# EAGLE design AskelmoottoriV3 (EAGLE 9.4.2)
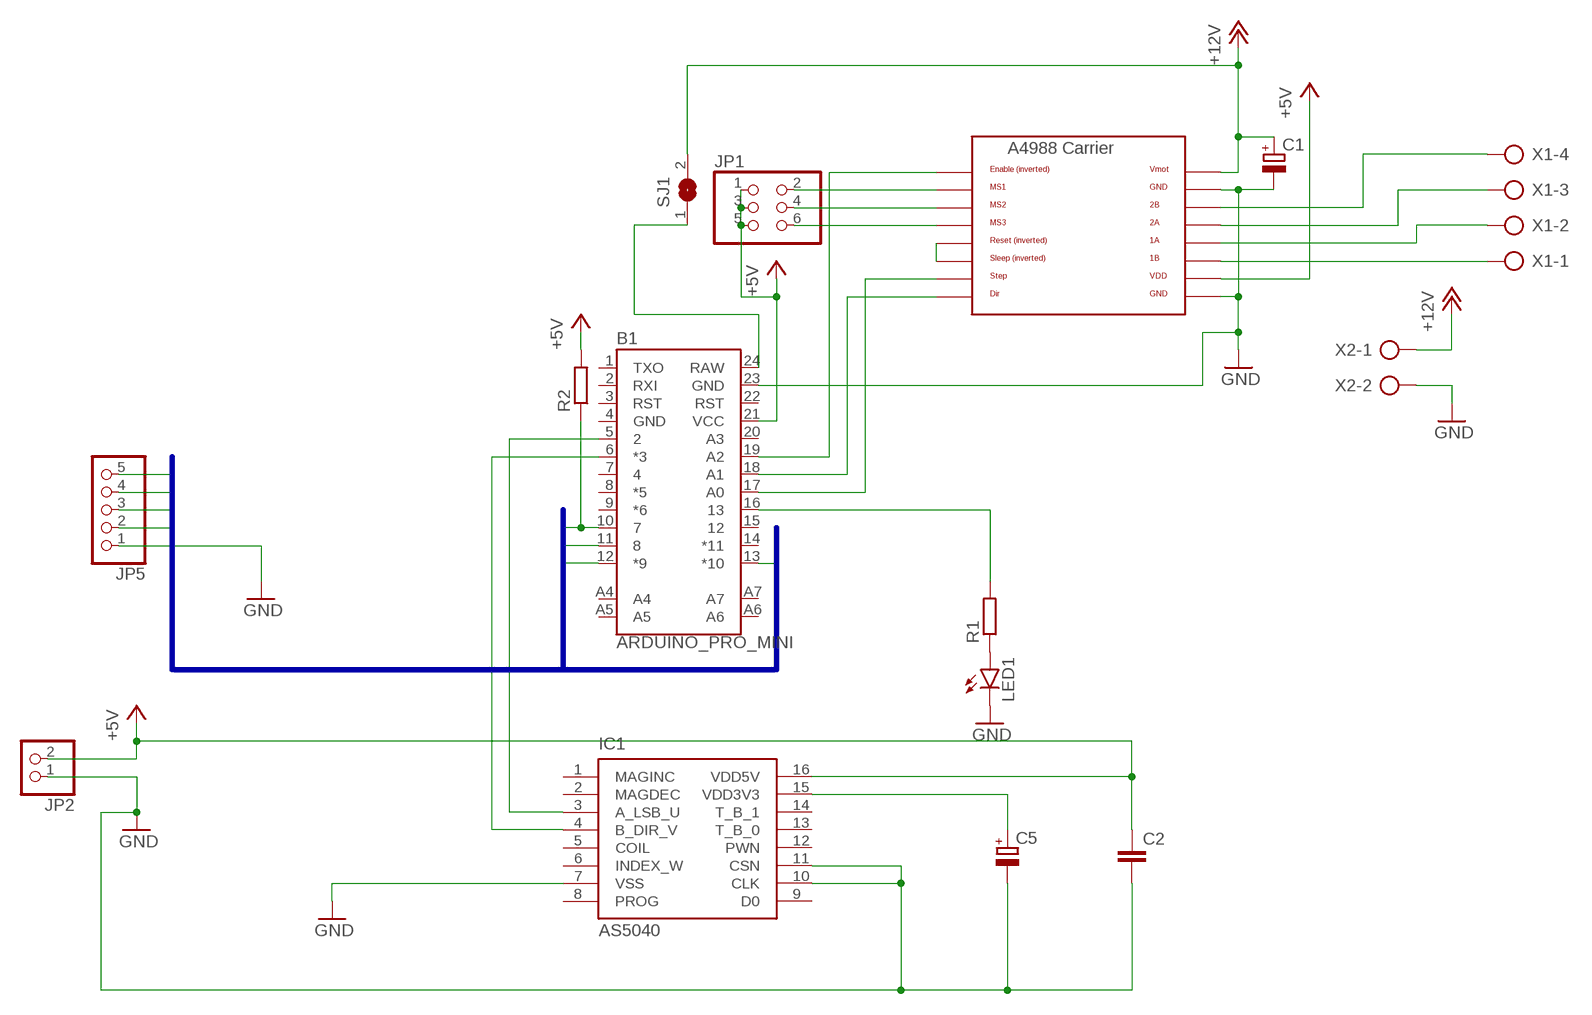
[diagram p0: schematic, sheet 1]

## Parts
B1  ARDUINO_PRO_MINI  [ARDUINO_PRO_MINI]
C1  CPOL-EUE5-8.5  [E5-8,5]
C2  C-EU025-030X050  [C025-030X050]
C5  CPOL-EUE2.5-5  [E2,5-5]
IC1  AS5040  [SSOP16]
JP1  PINHD-2X3  [2X03]
JP2  PINHD-1X2  [1X02]
JP5  PINHD-1X5  [1X05]
LED1  LED3MM  [LED3MM]
R1  R-EU_0207/10  [0207/10]
R2  R-EU_0207/10  [0207/10]
SJ1  SJ  [SJ]
U$1  A4988BREAKOUT  [A4988BREAKOUT]
X1  AK300/4  [AK300/4]
X2  AK300/2  [AK300/2]

## Nets
+5V: B1.21(VCC) C2.1 IC1.16(VDD5V) JP1.1 JP1.3 JP1.5 JP2.2 R2.2 U$1.VDD
+12V: C1.+ SJ1.2 U$1.VMOT X2.1
DIR: B1.12(*9) JP5.3
EN: B1.13(*10) JP5.4
FEED_HOLD: B1.10 JP5.5 R2.1
GND: B1.23(GND) C1.- C2.2 C5.- IC1.7(VSS) IC1.10(CLK) IC1.11(CSN) JP2.1 JP5.1 LED1.K(C) U$1.GND U$1.GND@0(GND) X2.2
N$1: U$1.2B X1.4
N$2: U$1.2A X1.3
N$3: U$1.1A X1.2
N$4: U$1.1B X1.1
N$6: B1.6(*3) IC1.4(B_DIR_V)
N$7: B1.16 R1.2
N$8: B1.17(A0) U$1.STEP
N$9: B1.18(A1) U$1.DIR
N$10: B1.19(A2) U$1.EN
N$11: U$1.RST U$1.SLP(SLEEP)
N$12: JP1.2 U$1.MS1
N$13: JP1.4 U$1.MS2
N$14: B1.24(RAW) SJ1.1
N$15: C5.+ IC1.15(VDD3V3)
N$16: JP1.6 U$1.MS3
N$17: B1.5 IC1.3(A_LSB_U)
N$20: LED1.A R1.1
STEP: B1.11 JP5.2
Unconnected: B1.1(TXO) B1.2(RXI) B1.3(RST) B1.7 B1.8(*5) B1.9(*6) B1.14(*11) B1.15 B1.20(A3) B1.22(RST) B1.A4 B1.A5 B1.A6 B1.A7 IC1.1(MAGINC) IC1.2(MAGDEC) IC1.5(COIL) IC1.6(INDEX_W) IC1.8(PROG) IC1.9(D0) IC1.12(PWN) IC1.13(T_B_0) IC1.14(T_B_1)

## Buses
STEP_IN_BUS:DIR,EN,FEED_HOLD,GND,STEP

## Power pins joined to a net without a drawn wire
GND: B1.4(GND)

## Library data of the parts
B1 = SparkFun-Boards:ARDUINO_PRO_MINI: SparkFun Pro Mini Pro Mini compatible footprint. Dimensions: 0.7 x 1.3" PCB Thickness: 0.8mm SparkFun Products: 3.3V/8MHz <https://www.sparkfun.com/products/11114> 5V/16MHz <https://www.sparkfun.com/products/11113>
C1 C5 = rcl:CPOL-EU: POLARIZED CAPACITOR, European symbol; SPICEPREFIX: C
C2 = rcl:C-EU: CAPACITOR, European symbol; SPICEPREFIX: C
IC1 = austriamicrosystems:AS5040: 10-BIT PROGRAMMABLE MAGNETIC ROTARY ENCODER Source: www.austriamicrosystems.com .. AS5040DataSheetRev12.pdf; MPN: AS5040ASSU; OC_FARNELL: 1630800; OC_NEWARK: 59P4059
JP1 = pinhead:PINHD-2X3: PIN HEADER
JP2 = pinhead:PINHD-1X2: PIN HEADER
JP5 = pinhead:PINHD-1X5: PIN HEADER
LED1 = led:LED: LED OSRAM: - CHIPLED LG R971, LG N971, LY N971, LG Q971, LY Q971, LO R971, LY R971 LH N974, LH R974 LS Q976, LO Q976, LY Q976 LO Q996 - Hyper CHIPLED LW Q18S LB Q993, LB Q99A, LB R99A - SideLED LS A670, LO A670, LY A670, LG A670, LP A670 LB A673, LV A673, LT A673, LW A673 LH A674 LY A675 LS A676, LA A676, LO A676, LY A676, LW A676 LS A679, LY A679, LG A679 - Hyper Micro SIDELED® LS Y876, LA Y876, LO Y876, LY Y876 LT Y87S - SmartLED LW L88C, LW L88S LB L89C, LB L89S, LG L890 LS L89K, LO L89K, LY L89K LS L896, LA L896, LO L896, LY L896 - TOPLED LS T670, LO T670, LY T670, LG T670, LP T670 LSG T670, LSP T670, LSY T670, LOP T670, LYG T670 LG T671, LOG T671, LSG T671 LB T673, LV T673, LT T673, LW T673 LH T674 LS T676, LA T676, LO T676, LY T676, LB T676, LH T676, LSB T676, LW T676 LB T67C, LV T67C, LT T67C, LS T67K, LO T67K, LY T67K, LW E67C LS E67B, LA E67B, LO E67B, LY E67B, LB E67C, LV E67C, LT E67C LW T67C LS T679, LY T679, LG T679 LS T770, LO T770, LY T770, LG T770, LP T770 LB T773, LV T773, LT T773, LW T773 LH T774 LS E675, LA E675, LY E675, LS T675 LS T776, LA T776, LO T776, LY T776, LB T776 LHGB T686 LT T68C, LB T68C - Hyper Mini TOPLED® LB M676 - Mini TOPLED Santana® LG M470 LS M47K, LO M47K, LY M47K Source: http://www.osram.convergy.de LUXEON: - LUMILED® LXK2-PW12-R00, LXK2-PW12-S00, LXK2-PW14-U00, LXK2-PW14-V00 LXK2-PM12-R00, LXK2-PM12-S00, LXK2-PM14-U00 LXK2-PE12-Q00, LXK2-PE12-R00, LXK2-PE12-S00, LXK2-PE14-T00, LXK2-PE14-U00 LXK2-PB12-K00, LXK2-PB12-L00, LXK2-PB12-M00, LXK2-PB14-N00, LXK2-PB14-P00, LXK2-PB14-Q00 LXK2-PR12-L00, LXK2-PR12-M00, LXK2-PR14-Q00, LXK2-PR14-R00 LXK2-PD12-Q00, LXK2-PD12-R00, LXK2-PD12-S00 LXK2-PH12-R00, LXK2-PH12-S00 LXK2-PL12-P00, LXK2-PL12-Q00, LXK2-PL12-R00 Source: www.luxeon.com KINGBRIGHT: KA-3528ASYC Source: www.kingbright.com
R1 R2 = rcl:R-EU_: RESISTOR, European symbol; SPICEPREFIX: R
SJ1 = jumper:SJ: SMD solder JUMPER
U$1 = RepRapjr:A4988BREAKOUT
X1 = con-ptr500:AK300/4: CONNECTOR; OC_FARNELL: unknown; OC_NEWARK: unknown
X2 = con-ptr500:AK300/2: CONNECTOR; OC_FARNELL: unknown; OC_NEWARK: unknown

## Board
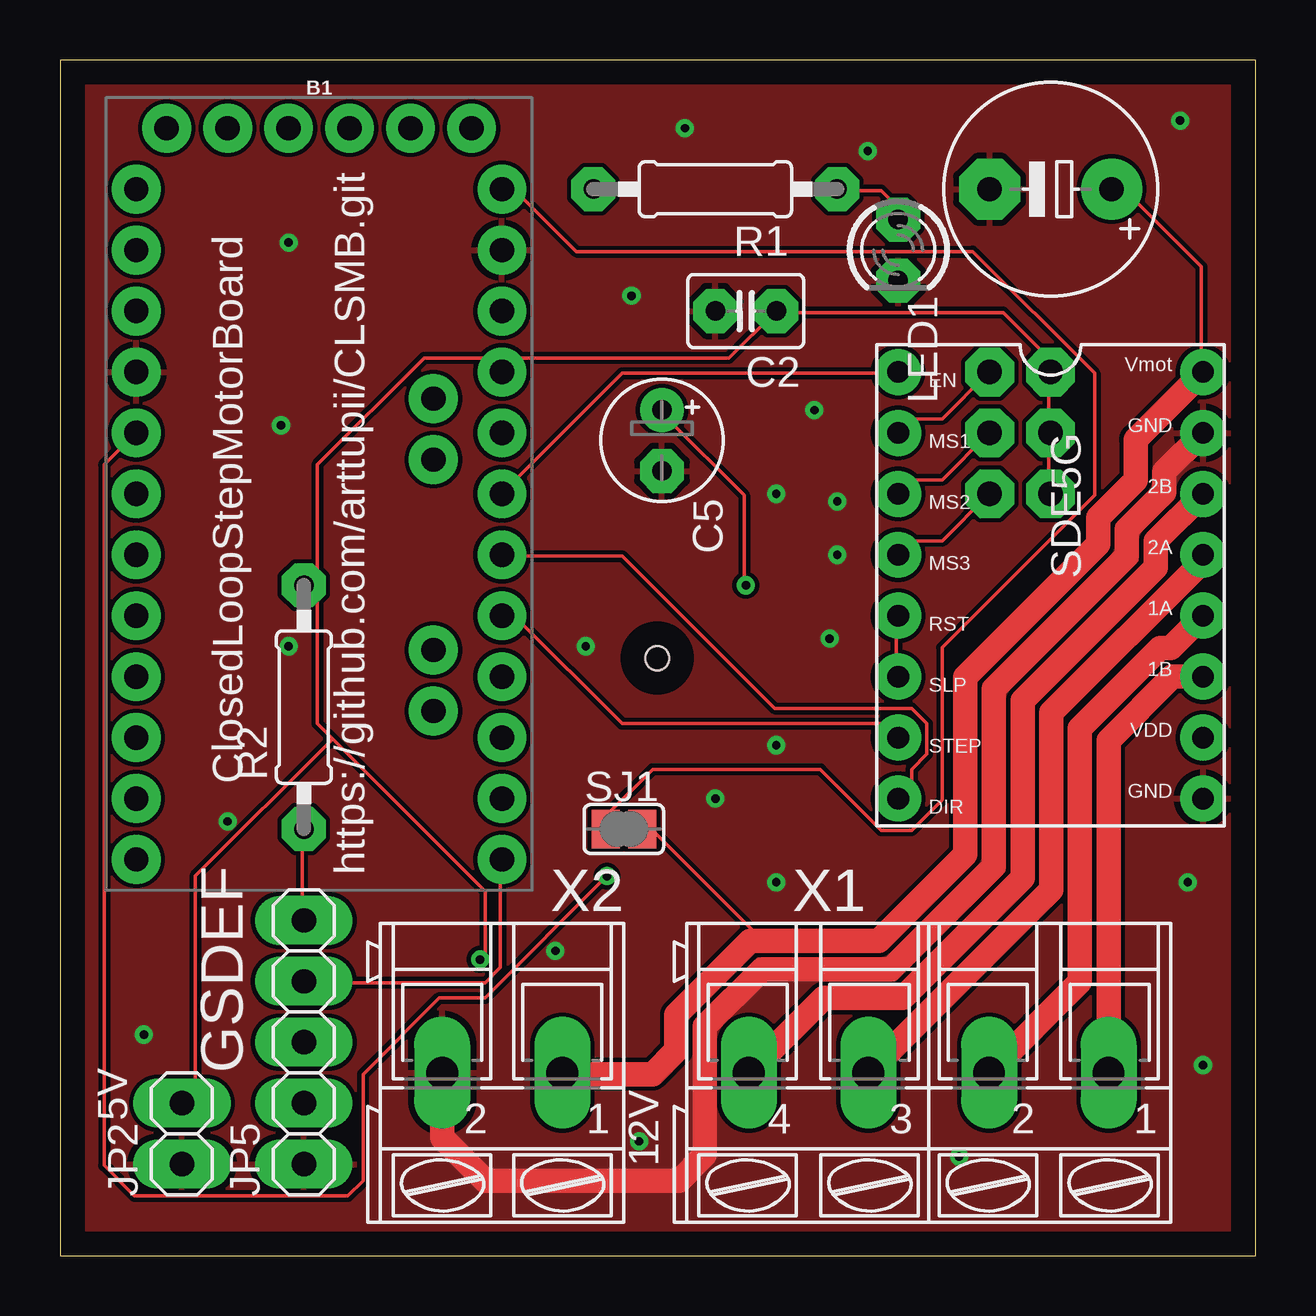
[diagram p1: board, top side]
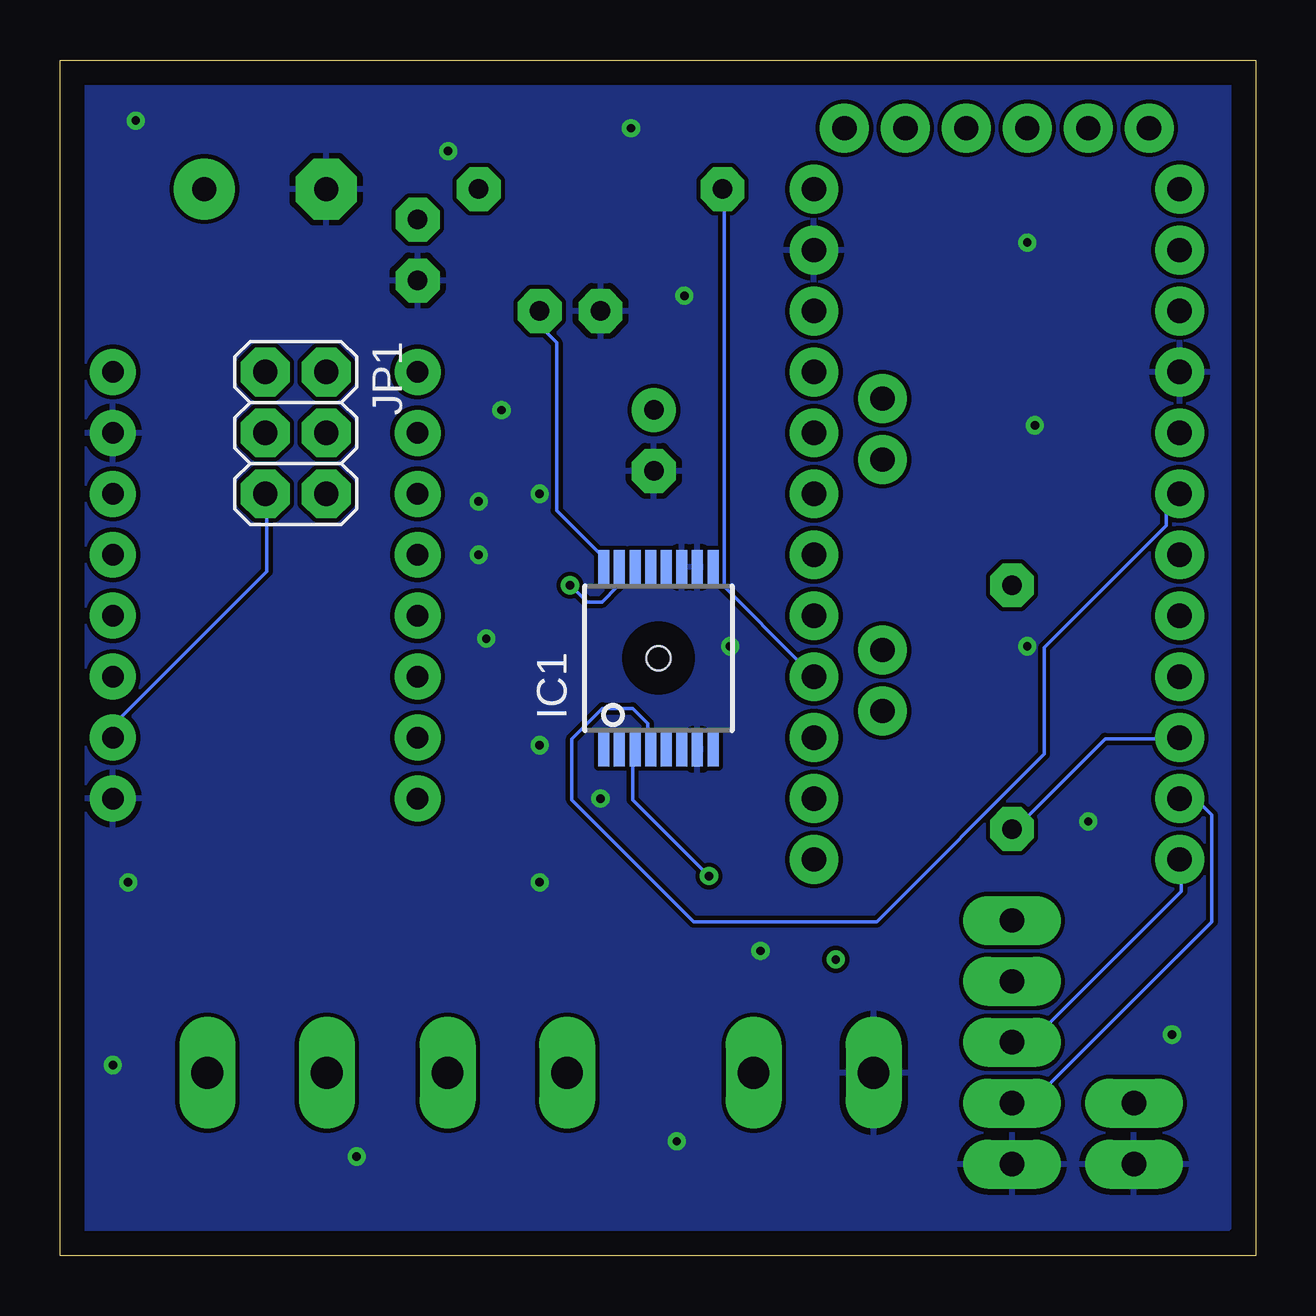
[diagram p2: board, bottom side, seen from below]

Size 49.83 x 49.84 mm. Coordinates in mm from the lower left corner, seen from the top.
Outline: 0,0 49.83,0 49.83,49.83 0,49.83 0,0
Copper layers (1*16): Top 0.035mm / dielectric 1.5mm / Bottom 0.035mm
Design rules "default *": minimum track width 6mil, minimum drill 0.35mm, track to track 7mil, track to pad 6mil, pad to pad 6mil, via to via 6mil, smd to smd 6mil, copper to edge 40mil, drill to drill 6mil, minimum pad ring 20mil, minimum via ring 8mil, stop-mask expansion 4mil, vias tented up to drill 0mil, thermal gap 10mil
Holes 1 mm at 24.89,24.9

### Footprints (pad centres in the part's own frame; a part is rotated, then mirrored left to right if it is on the bottom)
ARDUINO_PRO_MINI = drill 1.016 pad 1.88: 1 -7.62,12.7; 2 -7.62,10.16; 3 -7.62,7.62; 4 -7.62,5.08; 5 -7.62,2.54; 6 -7.62,0; 7 -7.62,-2.54; 8 -7.62,-5.08; 9 -7.62,-7.62; 10 -7.62,-10.16; 11 -7.62,-12.7; 12 -7.62,-15.24; 13 7.62,-15.24; 14 7.62,-12.7; 15 7.62,-10.16; 16 7.62,-7.62; 17 7.62,-5.08; 18 7.62,-2.54; 19 7.62,0; 20 7.62,2.54; 21 7.62,5.08; 22 7.62,7.62; 23 7.62,10.16; 24 7.62,12.7; A4 4.763,1.429; A5 4.763,3.969; A6 4.763,-9.049; A7 4.763,-6.509; BLK -6.35,15.24; GND -3.81,15.24; GRN 6.35,15.24; RXI 1.27,15.24; TXO 3.81,15.24; VCC -1.27,15.24
E5-8,5 = drill 1.016 pad 2.54: + -2.54,0 | drill 1.016 pad 2.54 octagon: - 2.54,0
C025-030X050 = drill 0.813 octagon: 1 -1.27,0; 2 1.27,0
E2,5-5 = drill 0.813 pad 1.6: + -1.27,0 | drill 0.813 pad 1.6 octagon: - 1.27,0
SSOP16 = smd 0.46 x 1.43: 1 -2.275,-3.795; 2 -1.625,-3.795; 3 -0.975,-3.795; 4 -0.325,-3.795; 5 0.325,-3.795; 6 0.975,-3.795; 7 1.625,-3.795; 8 2.275,-3.795; 9 2.275,3.795; 10 1.625,3.795; 11 0.975,3.795; 12 0.325,3.795; 13 -0.325,3.795; 14 -0.975,3.795; 15 -1.625,3.795; 16 -2.275,3.795
2X03 = drill 1.016 octagon: 1 -2.54,-1.27; 2 -2.54,1.27; 3 0,-1.27; 4 0,1.27; 5 2.54,-1.27; 6 2.54,1.27
1X02 = drill 1.016 long: 1 -1.27,0; 2 1.27,0
1X05 = drill 1.016 long: 1 -5.08,0; 2 -2.54,0; 3 0,0; 4 2.54,0; 5 5.08,0
LED3MM = drill 0.813 octagon: A -1.27,0; K 1.27,0
0207/10 = drill 0.813 octagon: 1 -5.08,0; 2 5.08,0
SJ = smd 1.168 x 1.6: 1 -0.762,0; 2 0.762,0
A4988BREAKOUT = drill 0.9: 1A 8.89,1.27; 1B 11.43,1.27; 2A 6.35,1.27; 2B 3.81,1.27; DIR 16.51,-11.43; EN -1.27,-11.43; GND 16.51,1.27; GND@0 1.27,1.27; MS1 1.27,-11.43; MS2 3.81,-11.43; MS3 6.35,-11.43; RST 8.89,-11.43; SLP 11.43,-11.43; STEP 13.97,-11.43; VDD 13.97,1.27; VMOT -1.27,1.27
AK300/4 = drill 1.321 long: 1 -7.493,0; 2 -2.515,0; 3 2.515,0; 4 7.493,0
AK300/2 = drill 1.321 long: 1 -2.515,0; 2 2.489,0

### Placement (x,y rotation side)
B1  10.79,31.75 0 top
C1  41.27,44.45 180 top
C2  28.58,39.37 180 top
C5  25.08,33.97 270 top
IC1  24.89,24.9 0 bottom
JP1  40.01,34.29 270 bottom
JP2  5.08,5.08 90 top
JP5  10.16,8.89 90 top
LED1  34.93,41.91 270 top
R1  27.3,44.45 180 top
R2  10.16,22.86 90 top
SJ1  23.5,17.78 0 top
U$1  46.36,35.56 270 top
X1  36.2,7.62 180 top
X2  18.42,7.62 180 top

### Tracks (layer width: path | path; a pad name or v marks a point on that pad's centre or on a via)
+5V  (via drill 0.35)
  Top 0.152: 11.36,21.53 10.72,22.17 10.72,27.88 R2.2 10.72,28.52 10.72,32.96 15.17,37.41 18.34,37.41 B1.21 18.98,37.41 27.87,37.41 29.77,39.31 C2.1 30.41,39.31 39.3,39.31 41.2,37.41 JP1.1 41.2,36.77 41.2,34.87 JP1.3 41.2,34.23 41.2,32.33 JP1.5 | 11.36,21.53 17.71,15.18 17.71,12.64 v17.5,12.34 | 11.36,21.53 5.64,15.82 5.64,6.93 JP2.2
  Bottom 0.152: IC1.16 27.23,29.15 29.14,31.06 29.14,38.04 30.41,39.31 C2.1 | U$1.VDD 47.55,22.17 41.2,28.52 41.2,31.69 JP1.5
+12V
  Top 0.152: SJ1.2 24.69,17.72 29.14,13.28 28.77,13.13 | U$1.VMOT 47.55,37.41 47.55,41.22 44.38,44.39 C1.+
  Top 1.016: U$1.VMOT 44.81,34.02 44.81,32.31 43.26,30.76 43.26,29.66 37.72,24.12 37.72,16.72 34.12,13.13 28.77,13.13 25.68,10.04 25.68,8.55 24.69,7.56 20.99,7.56 X2.1
DIR
  Bottom 0.152: JP5.3 10.09,9.47 8.82,9.47 3.1,15.18 3.1,16.45 B1.12
EN
  Top 0.152: JP5.4 10.72,11.37 17.71,11.37 18.34,12.01 18.34,16.45 B1.13
FEED_HOLD
  Top 0.152: R2.1 10.09,17.72 10.09,14.55 JP5.5
  Bottom 0.152: B1.10 3.74,21.53 6.28,21.53 10.09,17.72 R2.1
GND  (via drill 0.35)
  Top 1.016: U$1.GND@0 46.01,32.67 46.01,31.82 44.45,30.27 44.45,29.16 38.91,23.62 38.91,16.23 34.62,11.93 29.26,11.93 26.87,9.55 26.87,4.19 25.8,3.12 17.71,3.12 15.93,4.9 X2.2
  other vias: 26.04,46.99 47.62,7.94 9.53,42.23 9.21,34.61 9.53,25.4 6.98,18.1 3.49,9.21 24.13,4.76 37.47,4.13 46.99,15.56 29.85,15.56 20.64,12.7 29.85,21.27 32.07,25.72 21.91,25.4 32.38,31.43 33.66,46.04 46.67,47.31 31.43,35.24 23.81,40 32.38,29.21 29.85,31.75 27.3,19.05
  pour Top: 0.32,49.53 0.32,0.32 49.53,0.32 49.53,49.53
  pour Bottom: 0.32,49.53 0.32,1.91 1.91,0.32 49.53,0.32 49.53,49.53
N$1
  Top 1.016: X1.4 31.82,10.74 35.11,10.74 40.11,15.73 40.11,23.13 45.65,28.67 45.65,29.77 U$1.2B
N$2
  Top 1.016: X1.3 41.3,15.24 41.3,22.63 47.62,28.96 U$1.2A
N$3
  Top 1.016: X1.2 42.49,11.4 42.49,21.97 45.85,25.32 46.28,25.32 U$1.1A
N$4
  Top 1.016: X1.1 43.69,21.48 46.34,24.13 U$1.1B
N$6
  Bottom 0.152: IC1.4 25.33,21.53 25.33,22.17 25.96,22.8 27.23,22.8 28.5,21.53 28.5,18.99 23.42,13.91 15.8,13.91 8.82,20.9 8.82,25.34 3.74,30.42 3.74,31.69 B1.6
N$7
  Bottom 0.152: R1.2 22.15,44.39 22.15,27.88 18.98,24.71 B1.16
N$8
  Top 0.152: U$1.STEP 34.85,22.17 23.42,22.17 18.98,26.61 B1.17
N$9
  Top 0.152: U$1.DIR 35.49,19.63 35.49,20.26 36.12,20.9 36.12,22.17 35.49,22.8 29.77,22.8 23.42,29.15 18.98,29.15 B1.18
N$10
  Top 0.152: U$1.EN 34.85,36.77 23.42,36.77 18.98,32.33 B1.19
N$11
  Top 0.152: U$1.SLP 34.85,24.71 34.85,26.61 U$1.RST
N$12
  Top 0.152: U$1.MS1 35.49,34.87 36.76,34.87 38.66,36.77 JP1.2
N$13
  Top 0.152: U$1.MS2 35.49,32.33 36.76,32.33 38.66,34.23 JP1.4
N$14
  Top 0.152: SJ1.1 22.79,18.36 24.69,20.26 31.68,20.26 34.22,17.72 35.49,17.72 36.76,18.99 36.76,25.34 43.11,31.69 43.11,36.77 38.03,41.85 21.52,41.85 18.98,44.39 B1.24
N$15  (via drill 0.35)
  Top 0.152: v28.57,27.94 28.5,27.88 28.5,31.69 25.33,34.87 C5.+
  Bottom 0.152: IC1.15 26.6,28.52 26.6,27.88 27.23,27.25 27.87,27.25 28.5,27.88 v28.57,27.94
N$16
  Top 0.152: U$1.MS3 35.49,29.79 36.76,29.79 38.66,31.69 JP1.6
N$17  (via drill 0.35)
  Top 0.152: v22.79,15.82 17.71,10.74 15.8,10.74 12.63,7.56 12.63,3.12 11.99,2.48 3.1,2.48 1.83,3.75 1.83,32.96 3.1,34.23 B1.5
  Bottom 0.152: v22.79,15.82 25.96,18.99 25.96,20.9 IC1.3
N$20
  Top 0.152: R1.1 32.95,44.39 34.22,44.39 34.85,43.76 LED1.A
STEP
  Bottom 0.152: JP5.2 10.09,6.93 8.82,6.93 1.83,13.91 1.83,18.36 3.1,19.63 B1.11

### Text on the board
tPlace: SDE5G | ClosedLoopStepMotorBoard | https://github.com/arttupii/CLSMB.git | GSDEF | 5V | 12V
tValues: ClosedLoopStepMotorBoard 0.12 | https://github.com/arttupii/CLSMB.git